# EAGLE design S0-energy-meter-v1.1 (EAGLE 9.6.2)
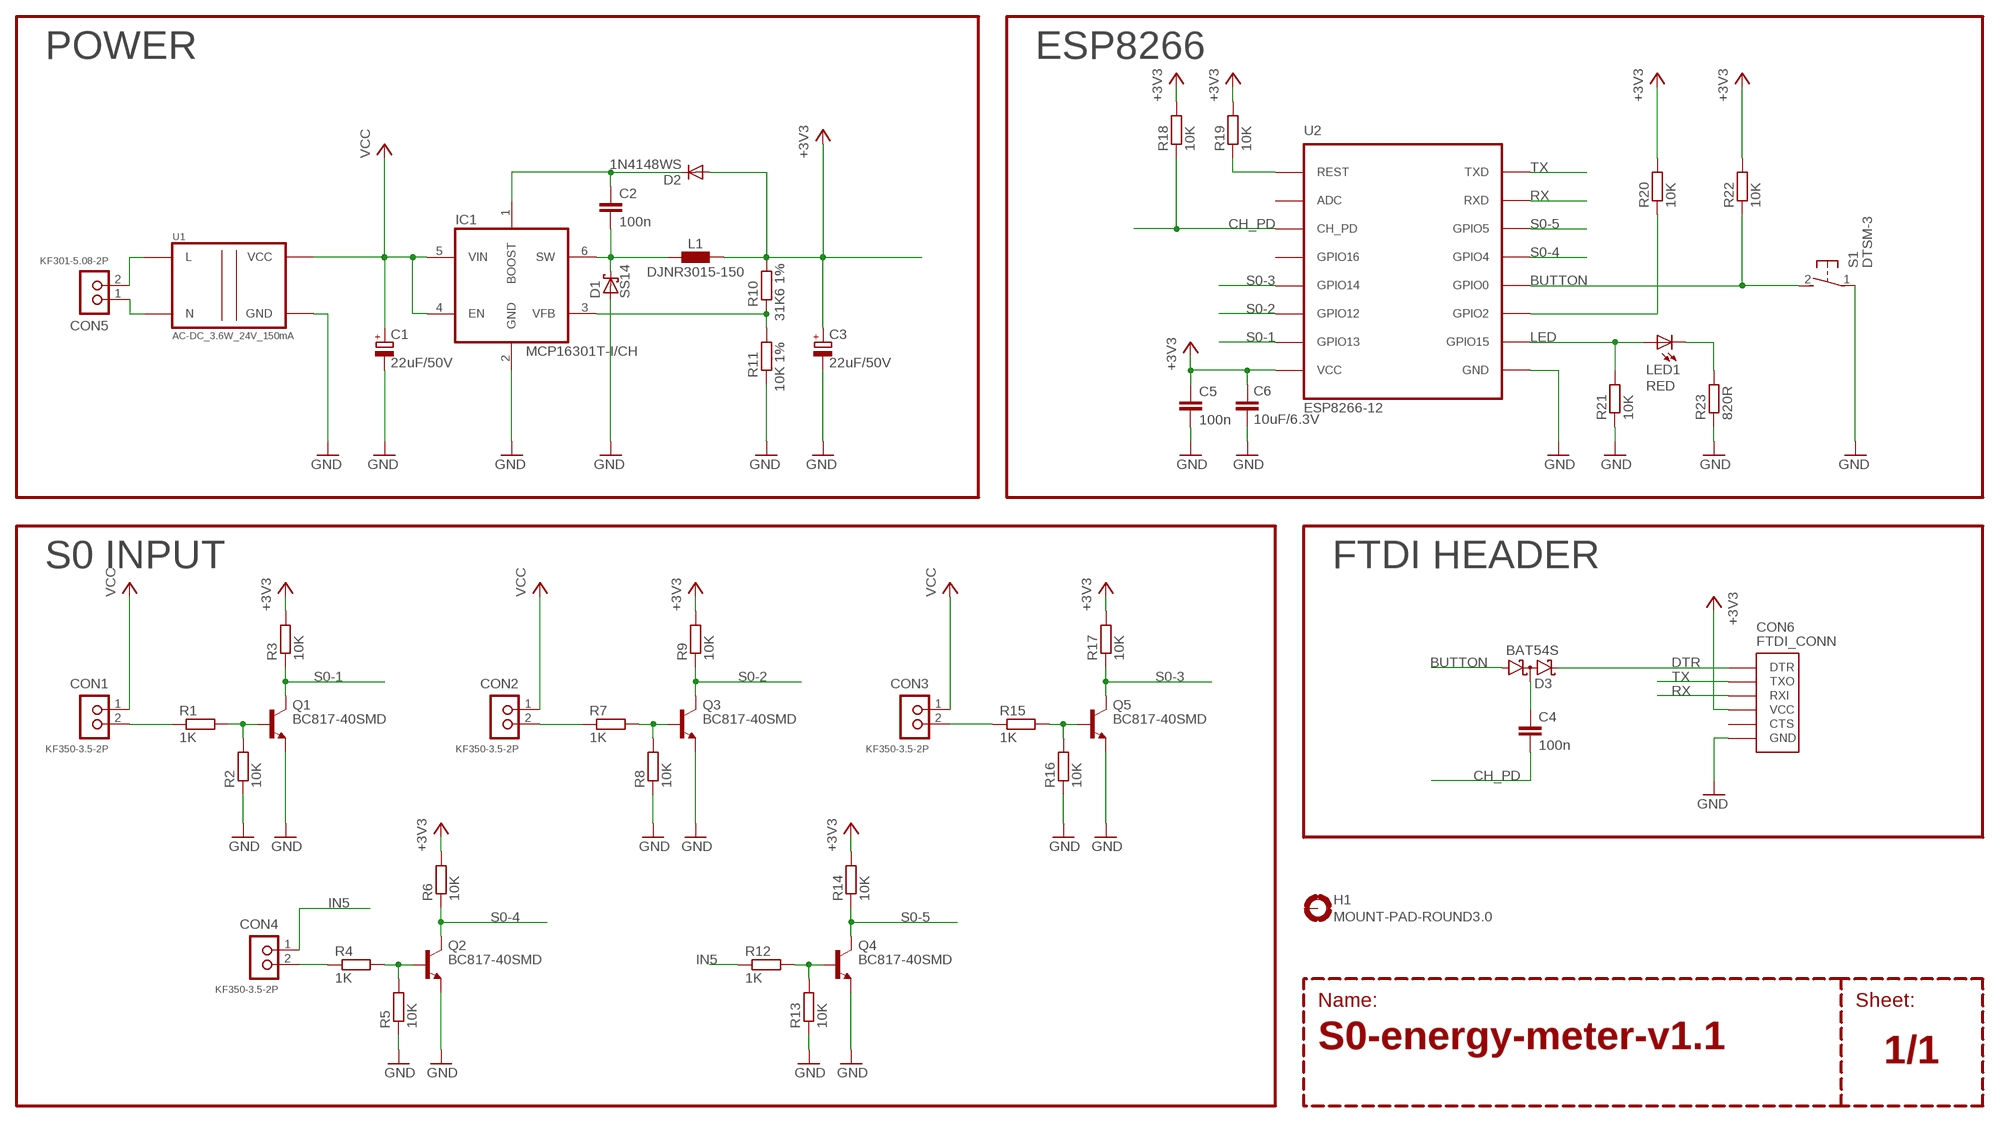
[diagram p0: schematic, sheet 1]

## Parts
C1  22uF/50V  CPOL-EUC  [PANASONIC_C]
C2  100n  C-EUC0805  [C0805]
C3  22uF/50V  CPOL-EUC  [PANASONIC_C]
C4  100n  C-EUC0805  [C0805]
C5  100n  C-EUC0805  [C0805]
C6  10uF/6.3V  C-EUC0805  [C0805]
CON1  KF350-3.5-2P  [KF350-3.50-2P]
CON2  KF350-3.5-2P  [KF350-3.50-2P]
CON3  KF350-3.5-2P  [KF350-3.50-2P]
CON4  KF350-3.5-2P  [KF350-3.50-2P]
CON5  KF301-5.08-2P  [KF301-5.08-2P]
CON6  FTDI_CONN  [FTDI]
D1  SS14  [DO214AC]
D2  1N4148WS  [SOD323]
D3  BAT54S  [SOT23]
H1  MOUNT-PAD-ROUND3.0  [3,0-PAD]
IC1  MCP16301T-I/CH  [SOT23-6]
L1  DJNR3015-150  [L3015]
LED1  RED  LED0805  [LED0805]
Q1  BC817-40SMD  [SOT23-BEC]
Q2  BC817-40SMD  [SOT23-BEC]
Q3  BC817-40SMD  [SOT23-BEC]
Q4  BC817-40SMD  [SOT23-BEC]
Q5  BC817-40SMD  [SOT23-BEC]
R1  1K  R-EU_R0805  [R0805]
R2  10K  R-EU_R0805  [R0805]
R3  10K  R-EU_R0805  [R0805]
R4  1K  R-EU_R0805  [R0805]
R5  10K  R-EU_R0805  [R0805]
R6  10K  R-EU_R0805  [R0805]
R7  1K  R-EU_R0805  [R0805]
R8  10K  R-EU_R0805  [R0805]
R9  10K  R-EU_R0805  [R0805]
R10  31K6 1%  R-EU_R0805  [R0805]
R11  10K 1%  R-EU_R0805  [R0805]
R12  1K  R-EU_R0805  [R0805]
R13  10K  R-EU_R0805  [R0805]
R14  10K  R-EU_R0805  [R0805]
R15  1K  R-EU_R0805  [R0805]
R16  10K  R-EU_R0805  [R0805]
R17  10K  R-EU_R0805  [R0805]
R18  10K  R-EU_R0805  [R0805]
R19  10K  R-EU_R0805  [R0805]
R20  10K  R-EU_R0805  [R0805]
R21  10K  R-EU_R0805  [R0805]
R22  10K  R-EU_R0805  [R0805]
R23  820R  R-EU_R0805  [R0805]
S1  DTSM-3  [DTSM-3]
U1  AC-DC_3.6W_24V_150mA  AC-DC_3.6W  [AC_DC_24V_150MA]
U2  ESP8266-12  [ESP-12]

## Nets
+3V3: C3.+ C5.1 C6.1 CON6.P$4(VCC) D2.A L1.1 R3.2 R6.2 R9.2 R10.2 R14.2 R17.2 R18.2 R19.2 R20.2 R22.2 U2.VCC
BUTTON: D3.1(A1) R22.1 S1.2 U2.GPIO0
CH: C4.1 D3.3(C1A2)
CH_PD: C4.2 R18.1 U2.CH_PD
DTR: CON6.P$1(DTR) D3.2(C2)
GND: C1.- C3.- C5.2 C6.2 CON6.P$6(GND) D1.A IC1.2(GND) Q1.E Q2.E Q3.E Q4.E Q5.E R2.1 R5.1 R8.1 R11.1 R13.1 R16.1 R21.1 R23.1 S1.1 U1.GND U2.GND
IN1: CON1.2 R1.1
IN2: CON2.2 R7.1
IN3: CON3.2 R15.1
IN4: CON4.2 R4.1
IN5: CON4.1 R12.1
LED: LED1.A R21.2 U2.GPIO15
N$1: LED1.C R23.2
N$3: Q1.B R1.2 R2.2
N$4: Q3.B R7.2 R8.2
N$6: Q5.B R15.2 R16.2
N$9: Q2.B R4.2 R5.2
N$10: R19.1 U2.REST
N$12: CON5.2 U1.L
N$13: CON5.1 U1.N
N$15: Q4.B R12.2 R13.2
N$16: C2.2 D1.C IC1.6(SW) L1.2
N$17: C2.1 D2.C IC1.1(BOOST)
N$18: IC1.3(VFB) R10.1 R11.2
N$25: R20.1 U2.GPIO2
RX: CON6.P$3(RXI) U2.RXD
S0-1: Q1.C R3.1 U2.GPIO13
S0-2: Q3.C R9.1 U2.GPIO12
S0-3: Q5.C R17.1 U2.GPIO14
S0-4: Q2.C R6.1 U2.GPIO4
S0-5: Q4.C R14.1 U2.GPIO5
TX: CON6.P$2(TXO) U2.TXD
VCC: C1.+ CON1.1 CON2.1 CON3.1 IC1.4(EN) IC1.5(VIN) U1.VCC
Unconnected: CON6.P$5(CTS) H1.B3,0(MOUNT) U2.ADC U2.GPIO16

## Notes on the sheet
- POWER | ESP8266
- S0 INPUT | FTDI HEADER
- Name: | Sheet:

## Library data of the parts
C1 C3 = rcl:CPOL-EU: POLARIZED CAPACITOR, European symbol; SPICEPREFIX: C
C2 C5 C6 = rcl:C-EU: CAPACITOR, European symbol; SPICEPREFIX: C
C4 = rcl:C-EU: CAPACITOR, European symbol
CON1-CON4 = my-con-terminal:KF350-3.5-2P: Screw terminal 3.5mm pitch
CON5 = my-con-terminal:KF301-?-2P: 2P Screw terminal
CON6 = my-connectors:FTDI_CONN: Connector which mates to FTDI basic or FTDI cable.
D1 = my-diode:SS?*: Schottky Barrier Rectifier; A: 1; V: 40
D2 = my-diode:1N4148: Fast Switching Diode
D3 = diode:BAT54S: Schottky Diodes Pin connection corrected 2011-05-04 Source: Fairchild .. BAT54.pdf
H1 = holes:MOUNT-PAD-ROUND: MOUNTING PAD, round
IC1 = my-power:MCP16301*T-I/?: High-Voltage Step-Down Regulator 4.0V to 30V / 4.7V to 36V (H)
L1 = my-inductor:DJNR?-*: SMD Power Coil; UH: 15
LED1 = my-opto:LED
Q1-Q5 = transistor-npn:BC817*: NPN Transistor
R1-R23 = rcl:R-EU_: RESISTOR, European symbol; SPICEPREFIX: R
S1 = switch-tact:DTSM-3
U1 = my-modules:AC-DC_?: AC-DC regulator; TYPE: 3.6W AC 110V/220V To DC 24V 150mA
U2 = my-ESP8266:ESP8266

## Board
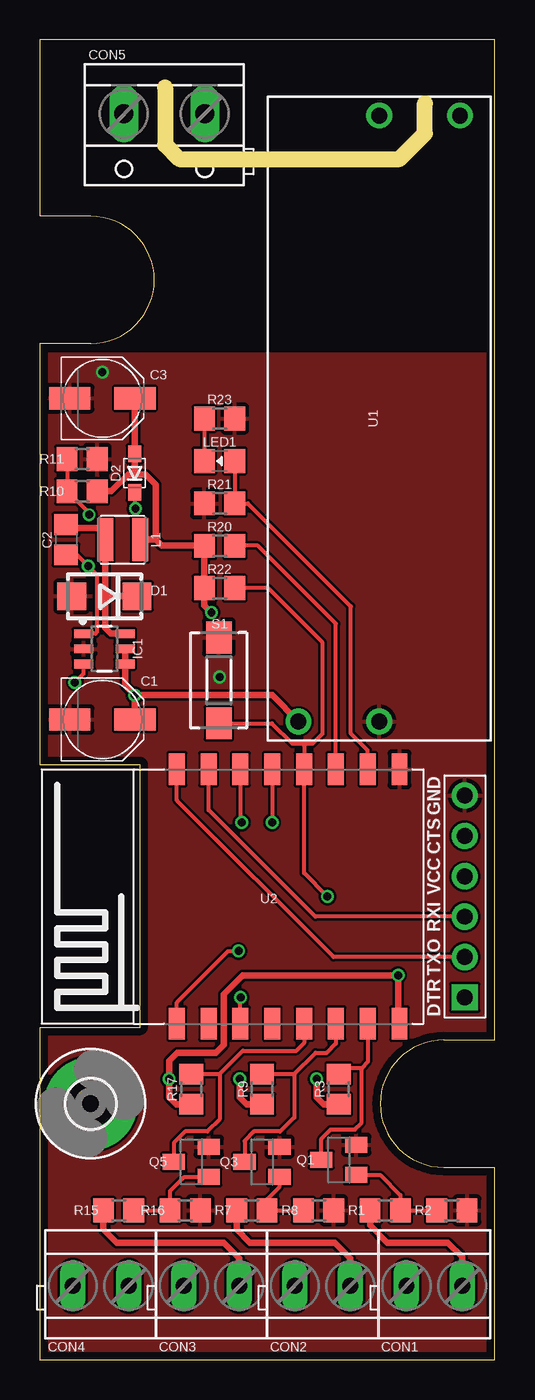
[diagram p1: board, top side]
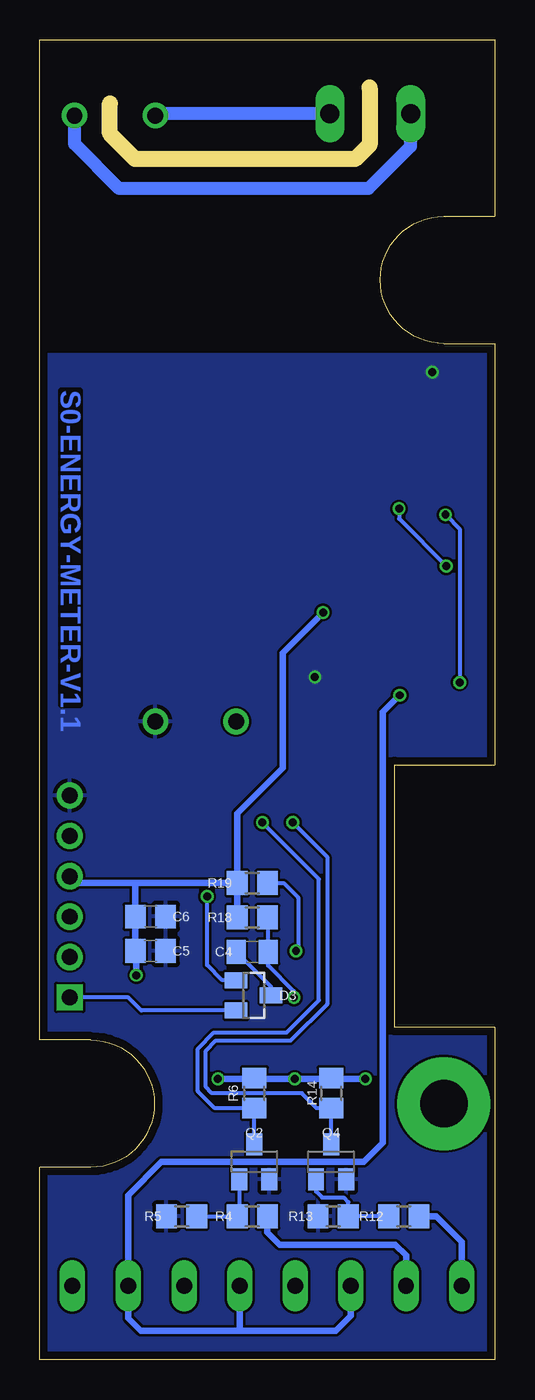
[diagram p2: board, bottom side, seen from below]

Size 28.6 x 83 mm. Coordinates in mm from the lower left corner, seen from the top.
Outline: 28.6,0 28.6,12.1 25.4,12.1 arc-180 25.4,20.1 28.6,20.1 28.6,83 0,83 0,71.9 3.2,71.9 arc-180 3.2,63.9 0,63.9 0,37.4 6.3,37.4 6.3,20.9 0,20.9 0,0 28.6,0
Copper layers (1*16): Top 0.035mm / dielectric 1.6mm / Bottom 0.035mm
Design rules "Elecrow_2-layer_optimal_PCB_eagle_rule": minimum track width 6mil, minimum drill 12mil, track to track 6mil, track to pad 6mil, pad to pad 6mil, via to via 8mil, smd to smd 0mil, copper to edge 20mil, drill to drill 10mil, minimum pad ring 12mil, minimum via ring 6mil, stop-mask expansion 0mil, vias tented up to drill 100mil, thermal gap 10mil
Milling: 5 lines

### Footprints (pad centres in the part's own frame; a part is rotated, then mirrored left to right if it is on the bottom)
PANASONIC_C = smd 2.6 x 1.4: + 2.05,0; - -2.05,0
C0805 = smd 1.3 x 1.5: 1 -0.95,0; 2 0.95,0
C0805' = smd 1.2 x 1.5: 1 -1,0; 2 1,0
KF350-3.50-2P = drill 1 long: 1 -1.75,0; 2 1.75,0
KF301-5.08-2P = drill 1.2 long: 1 -2.54,0; 2 2.54,0
FTDI = drill 1 pad 1.651 square: P$1 -6.35,0 | drill 1 pad 1.651: P$2 -3.81,0; P$3 -1.27,0; P$4 1.27,0; P$5 3.81,0; P$6 6.35,0
DO214AC = smd 1.8 x 1.7: A 2.05,0; C -2.05,0
SOD323 = smd 1.03 x 0.839: A 1.206,0; C -1.206,0
SOT23 = smd 1 x 1.4: 1 -0.95,-1.1; 2 0.95,-1.1; 3 0,1.1
3,0-PAD = drill 3 pad 5.842: B3,0 0,0
SOT23-6 = smd 1.2 x 0.55: 1 -1.3,0.95; 2 -1.3,0; 3 -1.3,-0.95; 4 1.3,-0.95; 5 1.3,0; 6 1.3,0.95
L3015 = smd 1 x 2.7: 1 -1.1,0; 2 1.1,0
LED0805 = smd 1.5 x 1.3: A 0,-0.95; C 0,0.95
SOT23-BEC = smd 1 x 1.4: B -0.95,-1.1; C 0,1.1; E 0.95,-1.1
R0805 = smd 1.3 x 1.5: 1 -0.95,0; 2 0.95,0
DTSM-3 = smd 2 x 1.6: 1 -2.7,0; 2 2.7,0
AC_DC_24V_150MA = drill 1: GND -19.05,0; L 19.05,-5.08; N 19.05,0; VCC -19.05,5.08
ESP-12 = smd 1 x 2: ADC -1.5,-8; CH_PD 0.5,-8; GND 10.5,8; GPIO0 4.5,8; GPIO2 6.5,8; GPIO4 2.5,8; GPIO5 0.5,8; GPIO12 6.5,-8; GPIO13 8.5,-8; GPIO14 4.5,-8; GPIO15 8.5,8; GPIO16 2.5,-8; REST -3.5,-8; RXD -1.5,8; TXD -3.5,8; VCC 10.5,-8

### Placement (x,y rotation side)
C1  3.94,40.26 0 top
C2  1.65,51.56 90 top
C3  3.94,60.45 0 top
C4  100n  [C0805']  15.24,25.65 0 bottom
C5  21.64,25.7 0 bottom
C6  21.64,27.86 0 bottom
CON1  24.8,4.65 0 top
CON2  17.77,4.65 0 top
CON3  10.8,4.65 0 top
CON4  3.83,4.65 0 top
CON5  7.83,78.35 180 top
CON6  26.72,29.13 90 top
D1  4.06,48.01 180 top
D2  5.97,55.75 90 top
D3  15.16,22.91 270 bottom
H1  3.2,16.1 0 top
IC1  4.06,44.7 0 top
L1  5.21,51.56 180 top
LED1  11.3,56.52 90 top
Q1  18.8,12.57 90 top
Q2  15.11,12.45 0 bottom
Q3  13.97,12.45 90 top
Q4  10.29,12.45 0 bottom
Q5  9.53,12.45 90 top
R1  21.72,9.4 0 top
R2  25.91,9.4 180 top
R3  18.8,17.02 270 top
R4  15.24,9.02 180 bottom
R5  19.68,9.02 0 bottom
R6  15.11,16.76 90 bottom
R7  13.34,9.4 0 top
R8  17.53,9.4 180 top
R9  13.97,17.02 270 top
R10  2.67,54.61 0 top
R11  2.67,56.64 180 top
R12  5.71,9.02 180 bottom
R13  10.16,9.02 0 bottom
R14  10.29,16.76 90 bottom
R15  4.95,9.4 0 top
R16  9.14,9.4 180 top
R17  9.53,17.02 270 top
R18  15.24,27.81 180 bottom
R19  15.24,29.97 180 bottom
R20  11.3,51.18 180 top
R21  11.3,53.85 0 top
R22  11.3,48.51 180 top
R23  11.3,59.18 180 top
S1  11.26,42.72 270 top
U1  21.34,59.18 90 top
U2  12.11,29.13 0 top

### Tracks (layer width: path | path; a pad name or v marks a point on that pad's centre or on a via)
+3V3  (via drill 0.5)
  Top 0.406: U2.VCC 22.53,21.22 v22.53,24.18 12.75,24.18 11.56,22.99 11.56,19.81 11.05,19.3 8.64,19.3 8.13,18.8 v8.13,17.65 8.13,16.51 8.57,16.07 R17.2 | R10.2 4.51,54.61 5.57,55.67 5.97,55.67 | 5.97,55.67 6.65,55.67 7.29,55.04 7.29,51.56 | 5.97,55.67 D2.A 5.97,60.43 C3.+ | L1.1 7.29,51.56 | 7.29,51.56 7.67,51.18 R20.2 R22.2 10.35,47.43 v10.79,46.99 | R9.2 13.02,16.07 12.57,16.51 v12.57,17.65 | R3.2 17.84,16.07 17.4,16.51 v17.4,17.65 | v12.57,17.65 | v17.4,17.65
  Bottom 0.406: v22.53,24.18 22.53,25.64 C5.1 C6.1 22.59,29.96 22.57,29.97 | R19.2 R18.2 | R19.2 22.57,29.97 | 22.57,29.97 26.29,29.97 CON6.P$4 | v10.79,46.99 13.34,44.45 13.34,37.21 16.19,34.36 R19.2 | v8.13,17.65 10.23,17.65 R14.2 10.35,17.65 v12.57,17.65 15.05,17.65 R6.2 15.17,17.65 v17.4,17.65
BUTTON  (via drill 0.5)
  Top 0.254: v18.08,29.13 16.61,30.6 U2.GPIO0 16.61,38.63 16.51,38.73 | 16.51,38.73 15.88,38.73 14.59,40.02 S1.2 | 16.51,38.73 17.14,38.73 17.78,39.37 17.78,45.09 14.35,48.51 R22.1
  Bottom 0.254: v18.08,29.13 18.08,24.81 17.13,23.86 D3.1
CH
  Bottom 0.254: D3.3 14.06,23.46 16.24,25.64 C4.1
CH_PD  (via drill 0.5)
  Top 0.254: U2.CH_PD v12.61,22.77 v12.62,22.78
  Bottom 0.254: v12.62,22.78 12.62,23.16 14.24,24.78 C4.2 14.24,27.76 R18.1
DTR
  Bottom 0.254: D3.2 22.21,21.96 23.04,22.78 CON6.P$1
GND  (via drill 0.5)
  other vias: 11.3,42.93 3.94,62.1
  pour Top: 0,20.9 0,0 28.6,0 28.6,12.1 25.4,12.1 arc-180 25.4,20.1 28.6,20.1 28.6,63.2 0,63.2 0,37.4 6.3,37.4 6.3,20.9
  pour Bottom: 0,20.9 0,0 28.6,0 28.6,12.1 25.4,12.1 arc-180 25.4,20.1 28.6,20.1 28.6,63.2 0,63.2 0,37.4 6.3,37.4 6.3,20.9
IN1
  Top 0.406: R1.1 20.77,8.44 21.84,7.37 25.65,7.37 26.55,6.47 CON1.2
IN2
  Top 0.406: R7.1 12.38,8.19 13.21,7.37 18.54,7.37 19.52,6.39 CON2.2
IN3
  Top 0.406: R15.1 4,8.19 4.83,7.37 11.56,7.37 12.55,6.37 CON3.2
IN4
  Bottom 0.406: R4.1 14.29,8 13.53,7.24 6.26,7.24 5.58,6.55 CON4.2
IN5
  Bottom 0.406: R12.1 3.68,9.02 2.08,7.41 CON4.1
LED
  Top 0.254: LED1.A R21.2 13.08,53.85 19.56,47.37 19.56,39.37 20.61,38.31 U2.GPIO15
N$1
  Top 0.254: R23.2 LED1.C
N$3
  Top 0.254: Q1.B 21.4,11.62 22.67,10.35 R1.2 R2.2
N$4
  Top 0.254: R8.2 R7.2 14.29,10.09 15.07,10.88 Q3.B
N$6
  Top 0.254: R15.2 R16.2 8.19,10.61 9.08,11.5 Q5.B
N$9
  Bottom 0.254: Q2.B 16.06,9.14 R4.2 R5.2
N$10  (via drill 0.5)
  Top 0.254: U2.REST 8.61,22.46 11.86,25.7 v12.49,25.7
  Bottom 0.254: R19.1 13.27,29.97 12.37,29.07 12.37,25.83 v12.49,25.7
N$12
  Bottom 0.813: U1.L 26.42,76.45 23.62,73.66 7.93,73.66 5.29,76.3 CON5.2
N$13
  Bottom 0.813: U1.N 21.22,78.35 CON5.1
N$15
  Bottom 0.254: Q4.B 11.24,10.58 10.86,10.2 9.51,10.2 9.21,9.91 R13.2 R12.2
N$16
  Top 0.406: C2.2 1.86,52.31 4.11,52.31 L1.2 4.11,48.01 | 4.11,48.01 D1.C | 4.11,48.01 4.11,46.02 4.47,45.65 IC1.6
N$17  (via drill 0.5)
  Top 0.254: C2.1 2.35,50.61 v3.05,49.91 3.6,49.35 3.6,45.77 3.49,45.65 IC1.1 | D2.C 5.97,53.56 v6.02,53.52
  Bottom 0.254: v6.02,53.52 6.02,52.88 v3.05,49.91
N$18  (via drill 0.5)
  Top 0.254: R11.2 R10.1 3.1,53.23 v3.1,53.13 | IC1.3 2.76,43.15 v2.21,42.59
  Bottom 0.254: v3.1,53.13 2.21,52.24 v2.21,42.59
N$25
  Top 0.254: R20.1 13.72,51.18 18.61,46.28 U2.GPIO2
RX
  Top 0.254: CON6.P$3 17.32,27.86 10.61,34.57 U2.RXD
S0-1
  Top 0.254: R3.1 19.23,18.4 19.29,18.34 20.23,18.34 | 20.23,18.34 20.23,14.9 19.81,14.48 18.29,14.48 17.7,13.89 Q1.C | U2.GPIO13 20.61,18.72 20.23,18.34
S0-2
  Top 0.254: Q3.C 12.87,13.76 13.46,14.35 15.11,14.35 16,15.24 16,17.97 | U2.GPIO12 18.61,19.88 18.03,19.3 17.34,19.3 16,17.97 | R9.1 16,17.97
S0-3
  Top 0.254: Q5.C 8.43,13.63 9.14,14.35 10.54,14.35 11.3,15.11 11.3,17.97 | U2.GPIO14 16.61,19.91 16.13,19.43 12.77,19.43 11.3,17.97 | R17.1 11.3,17.97
S0-4  (via drill 0.5)
  Top 0.254: U2.GPIO4 v14.61,33.79 v14.61,33.78
  Bottom 0.254: Q2.C R6.1 17.59,15.81 18.67,16.89 18.67,19.56 17.65,20.57 13.08,20.57 11.05,22.61 11.05,30.23 v14.61,33.78
S0-5  (via drill 0.5)
  Top 0.254: U2.GPIO5 12.61,33.87 v12.7,33.78
  Bottom 0.254: Q4.C R14.1 11.18,15.81 12.13,16.76 17.78,16.76 18.16,17.14 18.16,19.43 17.53,20.07 12.83,20.07 10.54,22.35 10.54,31.62 v12.7,33.78
TX
  Top 0.254: CON6.P$2 18.46,25.32 8.61,35.17 U2.TXD
VCC  (via drill 0.5)
  Top 0.406: U1.VCC 14.61,41.78 v5.97,41.78 | C1.+ 5.97,40.28 v5.97,41.78 | v5.97,41.78 5.36,42.39 IC1.4 IC1.5
  Bottom 0.406: 16.05,1.83 22.26,1.83 23.05,2.62 CON1.1 23.05,10.35 20.95,12.45 8.22,12.45 7.03,13.64 7.03,40.72 v5.97,41.78 | 16.05,1.83 9.98,1.83 9.05,2.76 CON3.1 | CON2.1 16.02,1.86 16.05,1.83

### Text on the board
Bottom: S0-ENERGY-METER-V1.1